# EAGLE design untitled (EAGLE 9.6.2)
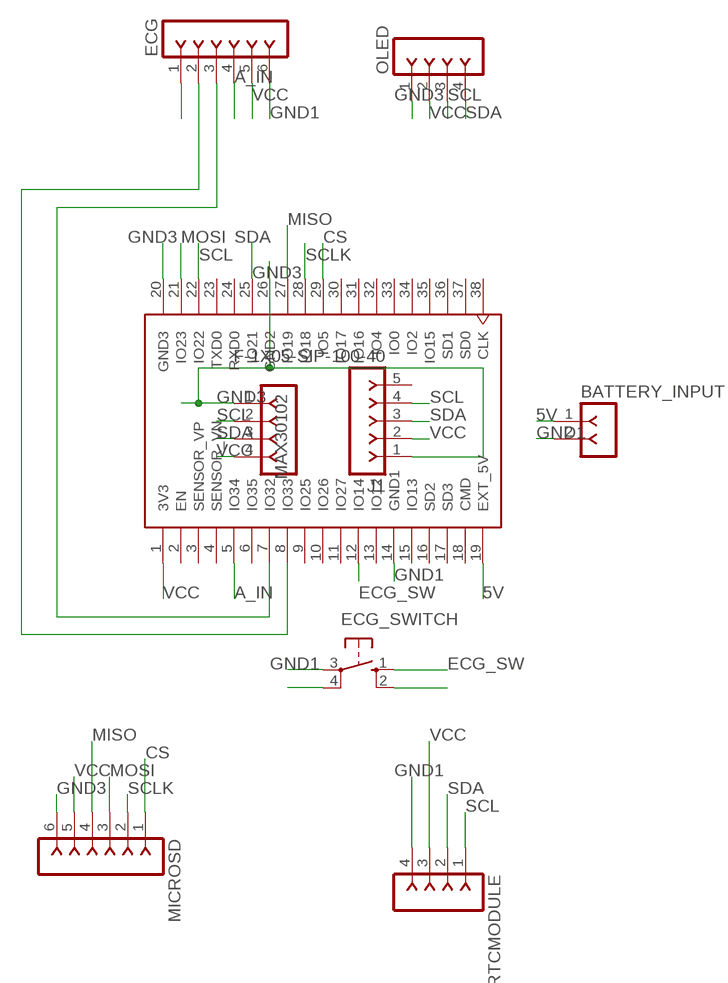
[diagram p0: schematic, sheet 1]

## Parts
BATTERY_INPUT  F-1X02-SIP-100-40  [SIP-100-02-40]
ECG  F-1X06-SIP-100-40  [SIP-100-06-40]
ECG_SWITCH  10-XX  [B3F-10XX]
J1  F-1X05-SIP-100-40  [SIP-100-05-40]
MAX30102  F-1X04-SIP-100-40  [SIP-100-04-40]
MICROSD  F-1X06-SIP-100-40  [SIP-100-06-40]
OLED  F-1X04-SIP-100-40  [SIP-100-04-40]
RTCMODULE  F-1X04-SIP-100-40  [SIP-100-04-40]
U1  ESP32-DEVKITC-32D  [MODULE_ESP32-DEVKITC-32D]

## Nets
5V: BATTERY_INPUT.1 U1.19(EXT_5V)
A_IN: ECG.4 U1.5(IO34)
CS: MICROSD.1 U1.29(IO5)
ECG_SW: ECG_SWITCH.1(S) U1.12(IO14)
GND1: BATTERY_INPUT.2 ECG.6 ECG_SWITCH.3(P) RTCMODULE.4 U1.14(GND1)
GND3: J1.1 MAX30102.1 MICROSD.6 OLED.1 U1.20(GND3) U1.26(GND2)
MISO: MICROSD.4 U1.27(IO19)
MOSI: MICROSD.3 U1.21(IO23)
N$2: ECG_SWITCH.4(P1)
N$4: ECG_SWITCH.2(S1)
N$7: ECG.1
N$8: ECG.2 U1.8(IO33)
N$9: ECG.3 U1.7(IO32)
SCL: J1.4 MAX30102.2 OLED.3 RTCMODULE.1 U1.22(IO22)
SCLK: MICROSD.2 U1.28(IO18)
SDA: J1.3 MAX30102.3 OLED.4 RTCMODULE.2 U1.25(IO21)
VCC: ECG.5 J1.2 MAX30102.4 MICROSD.5 OLED.2 RTCMODULE.3 U1.1(3V3)
Unconnected: J1.5 U1.2(EN) U1.3(SENSOR_VP) U1.4(SENSOR_VN) U1.6(IO35) U1.9(IO25) U1.10(IO26) U1.11(IO27) U1.13(IO12) U1.15(IO13) U1.16(SD2) U1.17(SD3) U1.18(CMD) U1.23(TXD0) U1.24(RXD0) U1.30(IO17) U1.31(IO16) U1.32(IO4) U1.33(IO0) U1.34(IO2) U1.35(IO15) U1.36(SD1) U1.37(SD0) U1.38(CLK)

## Library data of the parts
BATTERY_INPUT = con-headers-jp:F-1X02-: FEMALE HEADER
ECG MICROSD = con-headers-jp:F-1X06-: FEMALE HEADER
ECG_SWITCH = switch-omron:10-XX: OMRON SWITCH; MPN: B3F-1000; OC_FARNELL: 176432; OC_NEWARK: 36M3542
J1 = con-headers-jp:F-1X05-: FEMALE HEADER
MAX30102 OLED RTCMODULE = con-headers-jp:F-1X04-: FEMALE HEADER
U1 = KLEIN:ESP32-DEVKITC-32D: Eval Board For Esp-Wroom-32 Check prices <https://pricing.snapeda.com/parts/ESP32-DEVKITC-32D/Espressif%20Systems/view-part?ref=eda>; AVAILABILITY: Warning; DESCRIPTION: WiFi Development Tools (802.11) ESP32 General Development Kit, ESP32-WROOM-32D on the board; MF: Espressif Systems; MP: ESP32-DEVKITC-32D; PACKAGE: None; PRICE: None; PURCHASE-URL: https://pricing.snapeda.com/search/part/ESP32-DEVKITC-32D/?ref=eda

## Net classes
0 default: width 0.4 mm, clearance 0.2 mm

## Board
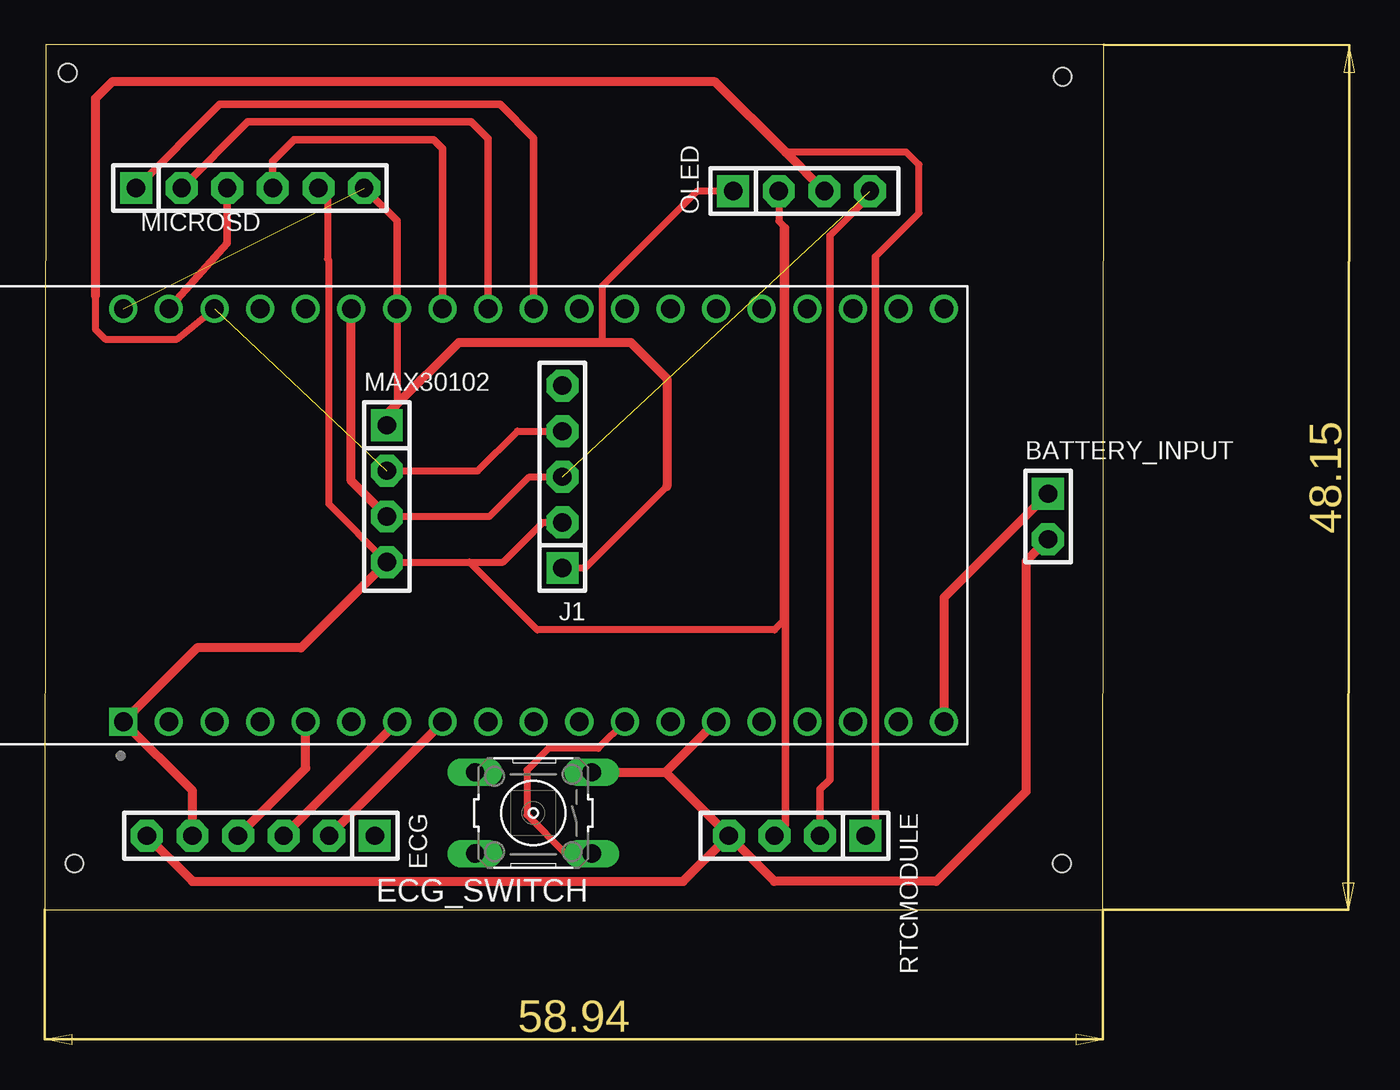
[diagram p1: board, top side]

Size 59 x 48.15 mm. Coordinates in mm from the lower left corner, seen from the top.
Outline: 0,0 58.94,0 59,48.15 0.06,48.15 0,0
Copper layers (1*16): Top 0.035mm / dielectric 1.5mm / Bottom 0.035mm
Design rules "default": minimum track width 6mil, minimum drill 0.35mm, track to track 6mil, track to pad 6mil, pad to pad 6mil, via to via 6mil, smd to smd 6mil, copper to edge 40mil, drill to drill 6mil, minimum pad ring 10mil, minimum via ring 8mil, stop-mask expansion 4mil, vias tented up to drill 0mil, thermal gap 10mil
Holes 1 mm at 1.27,46.6 56.7,46.38 56.65,2.57 1.65,2.57

### Footprints (pad centres in the part's own frame; a part is rotated, then mirrored left to right if it is on the bottom)
SIP-100-02-40 = drill 1.016 pad 1.778 square: 1 -1.27,0 | drill 1.016 pad 1.778 octagon: 2 1.27,0
SIP-100-06-40 = drill 1.016 pad 1.778 square: 1 -6.35,0 | drill 1.016 pad 1.778 octagon: 2 -3.81,0; 3 -1.27,0; 4 1.27,0; 5 3.81,0; 6 6.35,0
B3F-10XX = drill 1.016 long: 1 -3.251,2.261; 2 3.251,2.261; 3 -3.251,-2.261; 4 3.251,-2.261
SIP-100-05-40 = drill 1.016 pad 1.778 square: 1 -5.08,0 | drill 1.016 pad 1.778 octagon: 2 -2.54,0; 3 0,0; 4 2.54,0; 5 5.08,0
SIP-100-04-40 = drill 1.016 pad 1.778 square: 1 -3.81,0 | drill 1.016 pad 1.778 octagon: 2 -1.27,0; 3 1.27,0; 4 3.81,0
MODULE_ESP32-DEVKITC-32D = drill 1.04 square: 1 -12.7,19.76 | drill 1.04: 2 -12.7,17.22; 3 -12.7,14.68; 4 -12.7,12.14; 5 -12.7,9.6; 6 -12.7,7.06; 7 -12.7,4.52; 8 -12.7,1.98; 9 -12.7,-0.56; 10 -12.7,-3.1; 11 -12.7,-5.64; 12 -12.7,-8.18; 13 -12.7,-10.72; 14 -12.7,-13.26; 15 -12.7,-15.8; 16 -12.7,-18.34; 17 -12.7,-20.88; 18 -12.7,-23.42; 19 -12.7,-25.96; 20 10.3,19.76; 21 10.3,17.22; 22 10.3,14.68; 23 10.3,12.14; 24 10.3,9.6; 25 10.3,7.06; 26 10.3,4.52; 27 10.3,1.98; 28 10.3,-0.56; 29 10.3,-3.1; 30 10.3,-5.64; 31 10.3,-8.18; 32 10.3,-10.72; 33 10.3,-13.26; 34 10.3,-15.8; 35 10.3,-18.34; 36 10.3,-20.88; 37 10.3,-23.42; 38 10.3,-25.96

### Placement (x,y rotation side)
BATTERY_INPUT  55.88,21.89 270 top
ECG  12.03,4.11 180 top
ECG_SWITCH  27.21,5.38 180 top
J1  28.83,24.1 90 top
MAX30102  19.05,23.16 270 top
MICROSD  11.43,40.18 0 top
OLED  42.15,40.01 0 top
RTCMODULE  41.91,4.11 180 top
U1  24.13,23.16 90 top

### Tracks (layer width: path | path; a pad name or v marks a point on that pad's centre or on a via)
5V
  Top 0.508: BATTERY_INPUT.1 50.09,17.37 U1.19
A_IN
  Top 0.508: ECG.4 14.53,7.88 U1.5
CS
  Top 0.406: MICROSD.1 9.74,44.84 25.35,44.84 27.23,42.96 U1.29
ECG_SW
  Top 0.4: U1.12 30.82,8.97 28.05,8.97 26.85,7.77 26.85,5.27 29,3.12 ECG_SWITCH.1
GND1
  Top 0.508: BATTERY_INPUT.2 54.65,19.39 54.65,6.57 49.65,1.57 40.64,1.57 RTCMODULE.4 | ECG.6 8.22,1.57 35.56,1.57 RTCMODULE.4 | ECG_SWITCH.3 34.57,7.64 | RTCMODULE.4 34.57,7.64 | 34.57,7.64 U1.14
GND3  (1 unrouted)
  Top 0.4: OLED.1 36.34,40.01 31.05,34.72 31.05,31.57 | U1.26 19.61,28.13 19.55,28.07 | 34.65,23.57 30.1,19.02 J1.1
  Top 0.406: MICROSD.6 19.61,38.35 U1.26
  Top 0.508: 34.65,23.57 34.65,29.57 32.65,31.57 31.05,31.57 23.05,31.57 19.55,28.07 19.05,27.57 MAX30102.1
MISO
  Top 0.406: U1.27 22.15,42.37 21.66,42.86 13.88,42.86 12.7,41.68 MICROSD.4
MOSI
  Top 0.406: MICROSD.3 10.16,37.11 U1.21
N$8
  Top 0.508: ECG.2 22.15,10.42 U1.8
N$9
  Top 0.508: U1.7 19.61,10.42 ECG.3
SCL  (1 unrouted)
  Top 0.4: 2.81,34.2 2.81,32.3 3.35,31.77 7.36,31.77 U1.22 | 46.26,36.29 46.26,36.35 48.69,38.78 48.69,41.48 47.99,42.18 41.29,42.18 41.27,42.16 | 19.19,24.57 MAX30102.2 24.11,24.43 26.32,26.64 J1.4
  Top 0.406: RTCMODULE.1 46.26,4.65 46.26,36.29
  Top 0.508: OLED.3 41.27,42.16 37.34,46.09 3.75,46.09 2.81,45.16 2.81,34.2
SCLK
  Top 0.406: 7.69,40.18 MICROSD.2 11.31,43.87 23.75,43.87 24.69,42.93 U1.28
SDA  (1 unrouted)
  Top 0.4: 43.73,37.53 45.96,39.76 OLED.4 | MAX30102.3 24.77,21.89 26.98,24.1 J1.3
  Top 0.406: RTCMODULE.2 43.18,6.69 43.73,7.24 43.73,37.53
  Top 0.508: MAX30102.3 17.07,23.87 U1.25
VCC
  Top 0.4: OLED.2 40.88,38.34 41.15,38.07 | 41.15,38.07 41.25,37.97 | MICROSD.5 15.74,39.68 15.74,36.22 15.81,36.15 15.81,22.59 MAX30102.4 23.65,19.35 | 23.65,19.35 27.43,15.57 40.65,15.57 41.15,16.07 41.15,38.07 | 23.65,19.35 25.53,19.35 27.74,21.56 J1.2
  Top 0.406: 41.25,37.97 41.25,4.72 RTCMODULE.3
  Top 0.508: MAX30102.4 14.27,14.57 8.48,14.57 U1.1 8.22,6.61 ECG.5